# EAGLE design OPEnS-RTC-1.2 (improvements) (EAGLE 9.3.0)

## Sheet 1 of 2
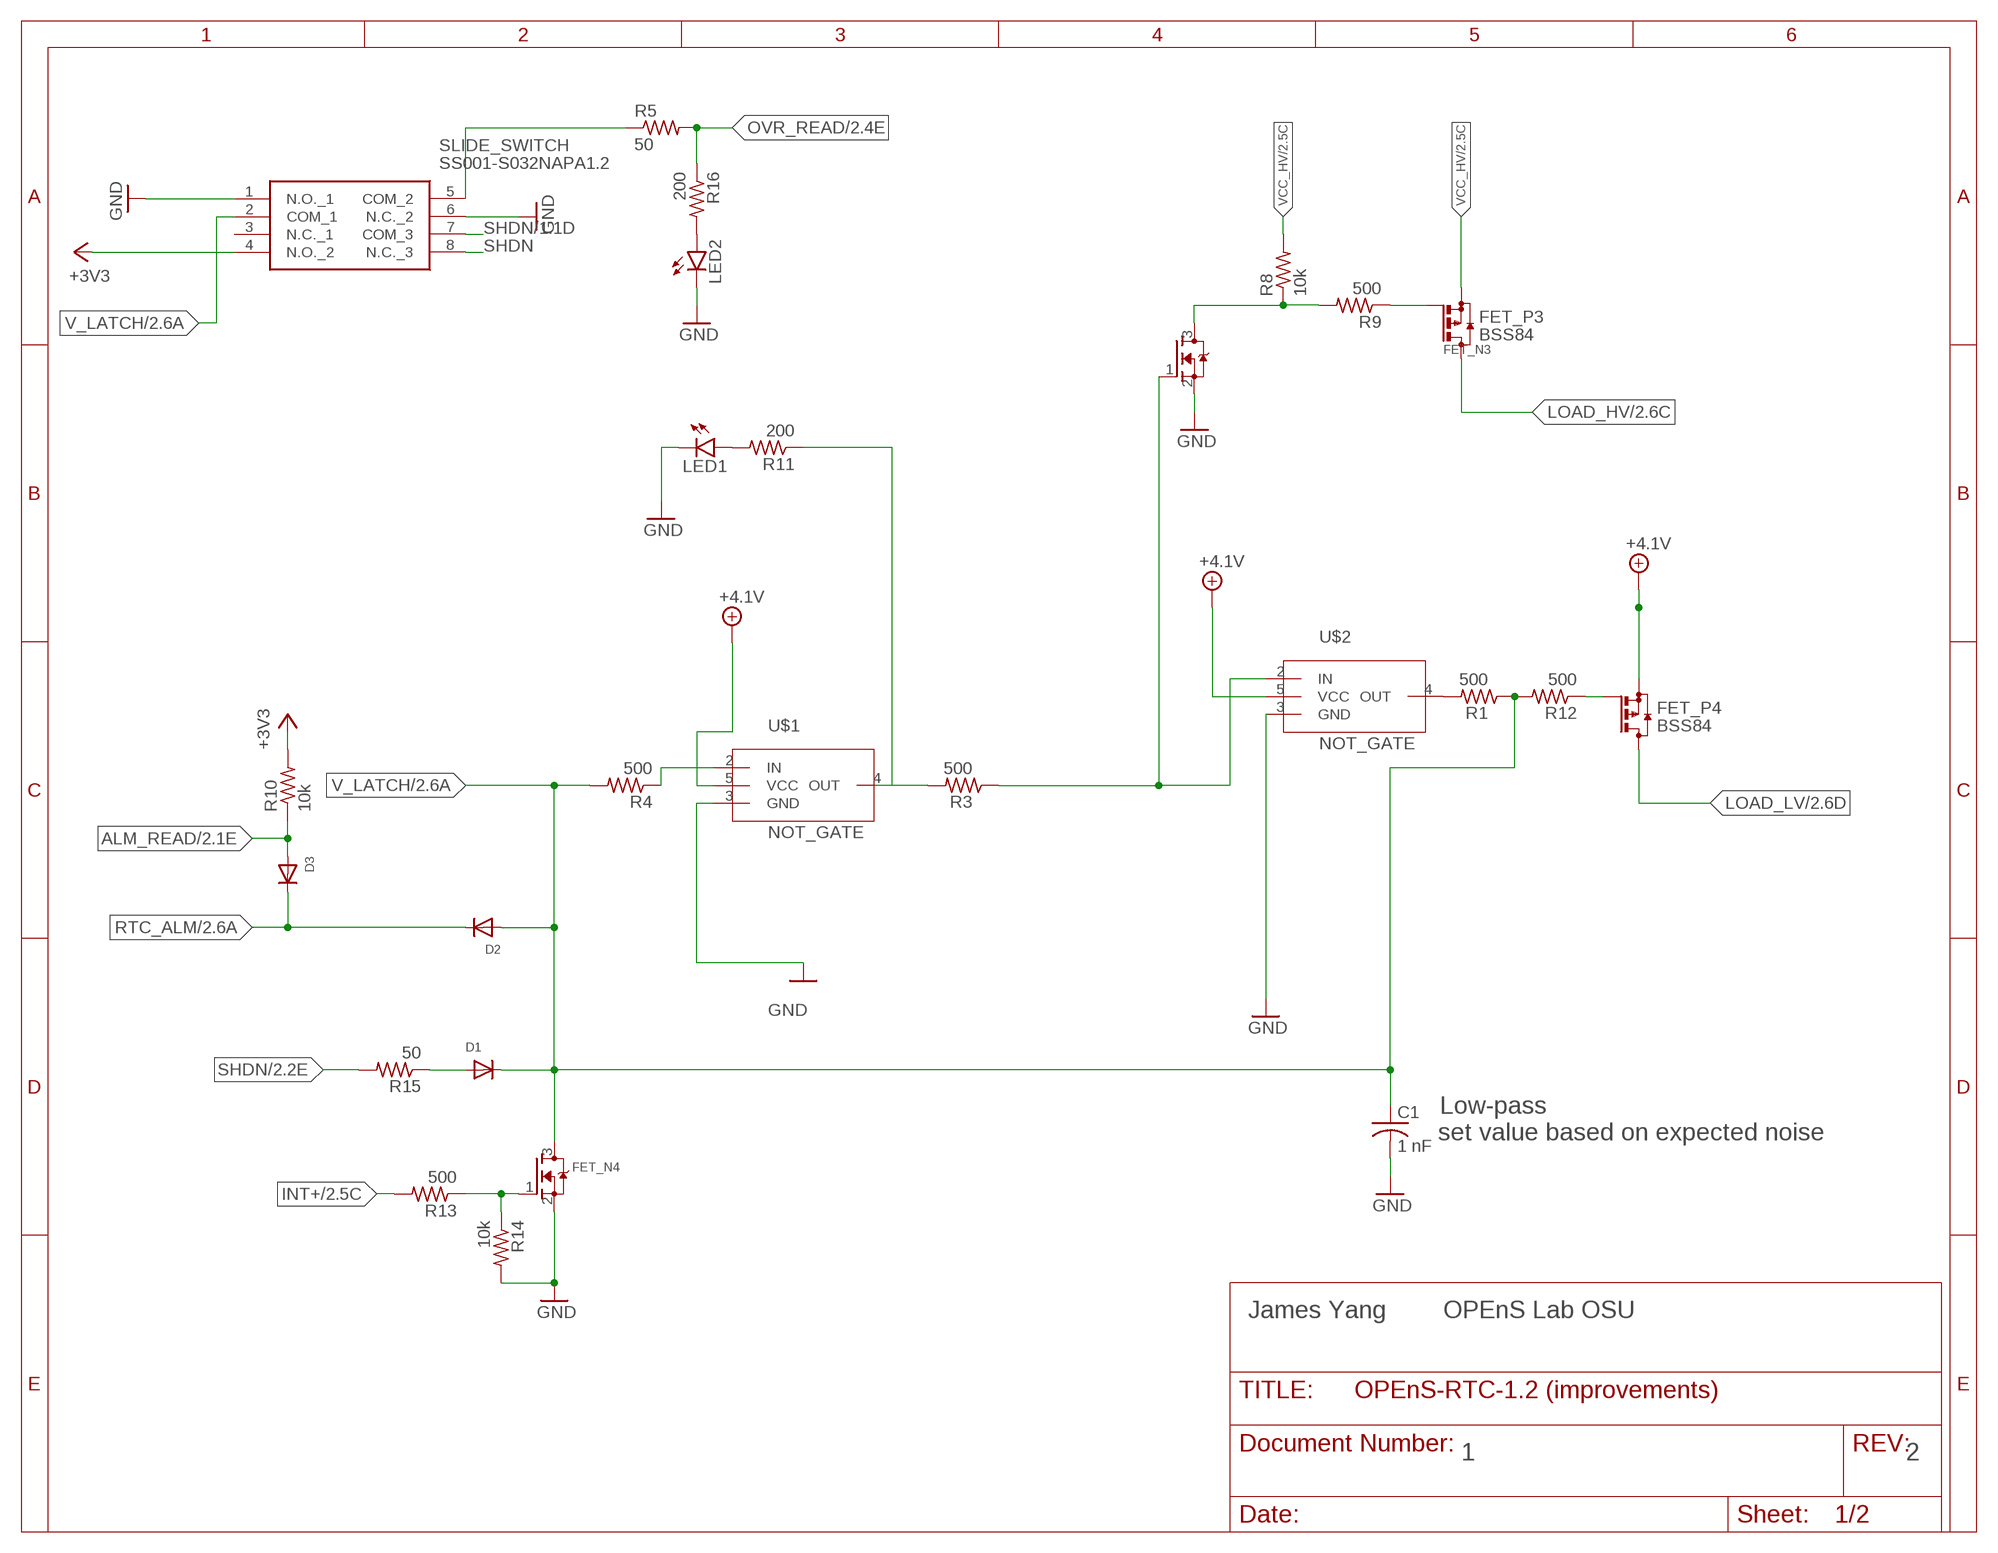
[diagram p0: schematic, sheet 1]

### Parts
C1  1 nF  C-USC0805  [C0805]
D1  DIODESOD-123  [SOD-123]
D2  DIODESOD-123  [SOD-123]
D3  DIODESOD-123  [SOD-123]
FET_N3  MOSFET-NREFLOW  [SOT23]
FET_N4  MOSFET-NREFLOW  [SOT23]
FET_P3  BSS84  [SOT23]
FET_P4  BSS84  [SOT23]
LED1  LEDSMT1206  [1206]
LED2  LEDSMT1206  [1206]
R1  500  R-US_R0805  [R0805]
R3  500  R-US_R0805  [R0805]
R4  500  R-US_R0805  [R0805]
R5  50  R-US_R0805  [R0805]
R8  10k  R-US_R0805  [R0805]
R9  500  R-US_R0805  [R0805]
R10  10k  R-US_R0805  [R0805]
R11  200  R-US_R0805  [R0805]
R12  500  R-US_R0805  [R0805]
R13  500  R-US_R0805  [R0805]
R14  10k  R-US_R0805  [R0805]
R15  50  R-US_R0805  [R0805]
R16  200  R-US_R0805  [R0805]
SLIDE_SWITCH  SS001-S032NAPA1.2  [SS001S032NAPA12]
U$1  NOT_GATE  [SOT753]
U$2  NOT_GATE  [SOT753]

### Nets
+3V3: R10.2 SLIDE_SWITCH.4(N.O._2)
+4.1V: FET_P4.2(S) U$1.5(VCC) U$2.5(VCC) ; also sheet 2
ALM_READ: D3.A R10.1 ; also sheet 2
GND: C1.2 FET_N3.2(S) FET_N4.2(S) LED1.C LED2.C R14.2 SLIDE_SWITCH.1(N.O._1) SLIDE_SWITCH.6(N.C._2) U$1.3(GND) U$2.3(GND) ; also sheet 2
INT+: R13.2 ; also sheet 2
LOAD_HV: FET_P3.3(D) ; also sheet 2
LOAD_LV: FET_P4.3(D) ; also sheet 2
N$1: R11.1 U$1.4(OUT)
N$2: R4.1 U$1.2(IN)
N$3: R1.2 U$2.4(OUT)
N$4: FET_N3.1(G) R3.1 U$2.2(IN)
N$5: FET_N3.3(D) R8.1 R9.2
N$7: R5.1 SLIDE_SWITCH.5(COM_2)
N$8: FET_P3.1(G) R9.1
N$9: LED1.A R11.2
N$10: FET_P4.1(G) R12.1
N$11: D1.A R15.1
N$12: FET_N4.1(G) R13.1 R14.1
N$13: LED2.A R16.2
OVR_READ: R5.2 R16.1 ; also sheet 2
RTC_ALM: D2.C D3.C ; also sheet 2
SHDN: R15.2 SLIDE_SWITCH.8(N.C._3) ; also sheet 2
SHDN/1.1D: SLIDE_SWITCH.7(COM_3)
V_LATCH: C1.1 D1.C D2.A FET_N4.3(D) R1.1 R4.2 R12.2 SLIDE_SWITCH.2(COM_1) ; also sheet 2
V_LATCH1: R3.2
VCC_HV: FET_P3.2(S) R8.2 ; also sheet 2
Unconnected: SLIDE_SWITCH.3(N.C._1)

### Notes on the sheet
- Low-pass
- set value based on expected noise
- James Yang | OPEnS Lab OSU
- 1 | 2

## Sheet 2 of 2
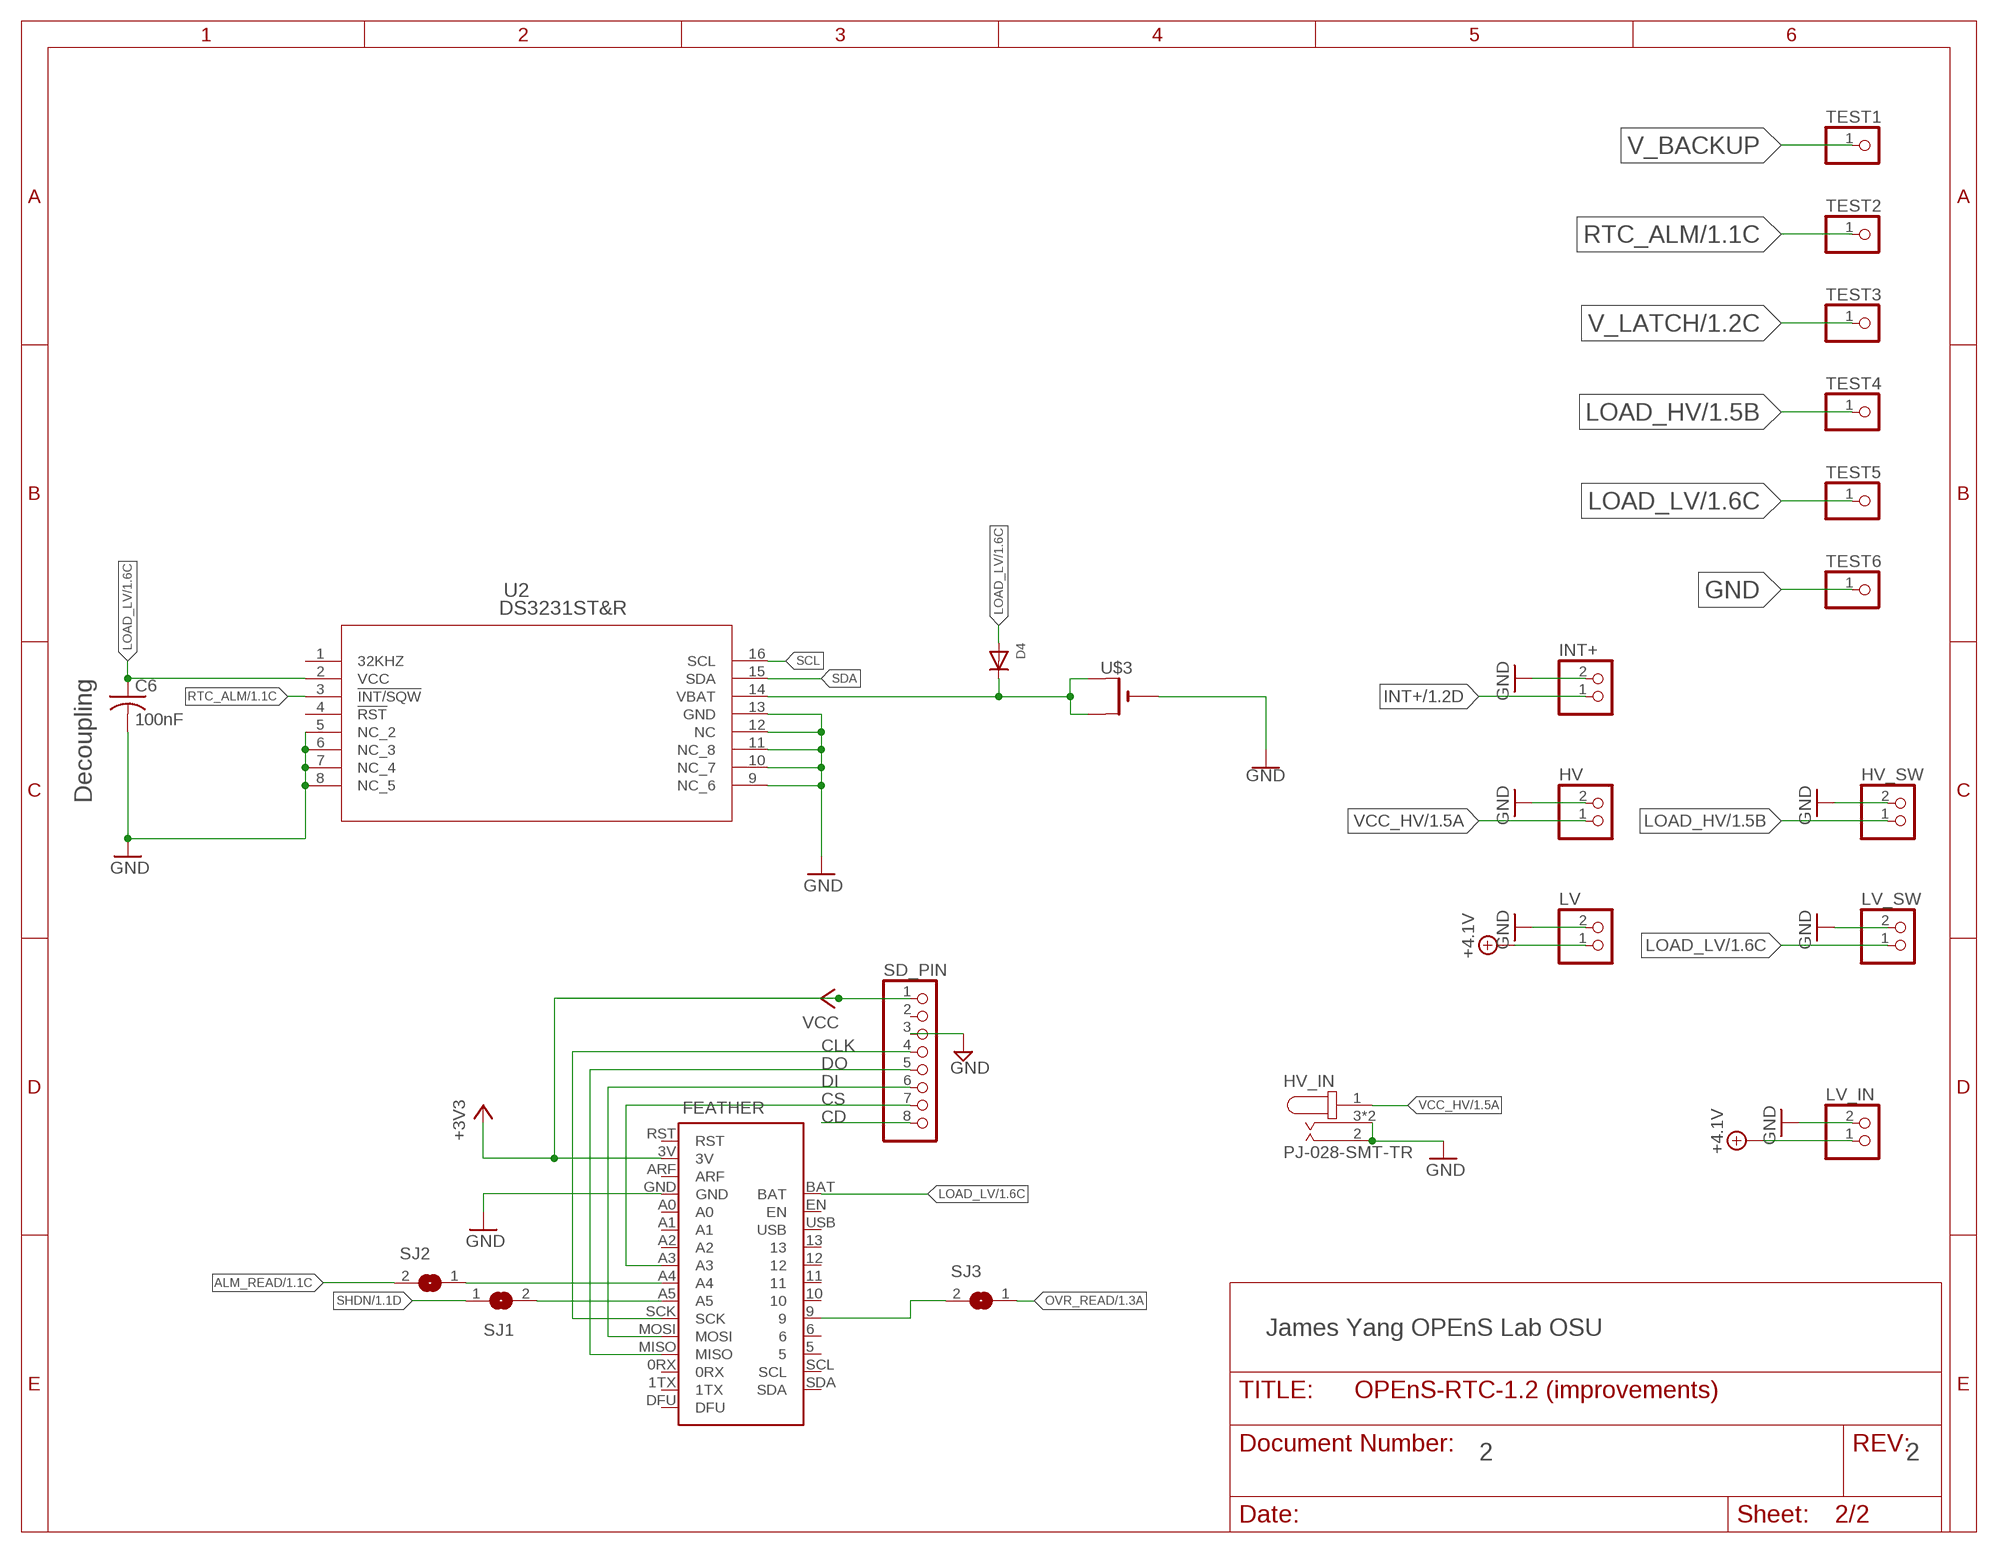
[diagram p1: schematic, sheet 2]

### Parts
C6  100nF  C-USC0805  [C0805]
D4  DIODESOD-123  [SOD-123]
FEATHER  BLUEFRUIT_M0  [BLUEFRUIT_MO]
HV  JST_2PIN-SMT  [JST-PH-2-SMT]
HV_IN  PJ-028-SMT-TR  [CUI_PJ-028-SMT-TR]
HV_SW  JST_2PIN-SMT  [JST-PH-2-SMT]
INT+  JST_2PIN-SMT  [JST-PH-2-SMT]
LV  JST_2PIN-SMT  [JST-PH-2-SMT]
LV_IN  JST_2PIN-SMT  [JST-PH-2-SMT]
LV_SW  JST_2PIN-SMT  [JST-PH-2-SMT]
SD_PIN  PINHD-1X8BIG  [1X08-BIG]
SJ1  SJ  [SJ]
SJ2  SJ  [SJ]
SJ3  SJ  [SJ]
TEST1  PINHD-1X1  [1X01]
TEST2  PINHD-1X1  [1X01]
TEST3  PINHD-1X1  [1X01]
TEST4  PINHD-1X1  [1X01]
TEST5  PINHD-1X1  [1X01]
TEST6  PINHD-1X1  [1X01]
U2  DS3231ST&R  [21-0042B_16]
U$3  CR1220SMT  [CR1220-SMD]

### Nets
+4.1V: LV.1 LV_IN.1 ; also sheet 1
ALM_READ: SJ2.2 ; also sheet 1
CD: SD_PIN.8
CLK: FEATHER.SCK SD_PIN.4
CS: FEATHER.A3 SD_PIN.7
DI: FEATHER.MOSI SD_PIN.6
DO: FEATHER.MISO SD_PIN.5
GND: C6.2 FEATHER.GND HV.2 HV_IN.2 HV_IN.3 HV_IN.3.1 HV_SW.2 INT+.2 LV.2 LV_IN.2 LV_SW.2 SD_PIN.3 TEST6.1 U2.5(NC_2) U2.6(NC_3) U2.7(NC_4) U2.8(NC_5) U2.9(NC_6) U2.10(NC_7) U2.11(NC_8) U2.12(NC) U2.13(GND) U$3.- ; also sheet 1
INT+: INT+.1 ; also sheet 1
LOAD_HV: HV_SW.1 TEST4.1 ; also sheet 1
LOAD_LV: C6.1 D4.A FEATHER.BAT LV_SW.1 TEST5.1 U2.2(VCC) ; also sheet 1
N$14: FEATHER.A4 SJ2.1
N$15: FEATHER.A5 SJ1.2
N$17: FEATHER.9 SJ3.2
OVR_READ: SJ3.1 ; also sheet 1
RTC_ALM: TEST2.1 U2.3(!INT/SQW) ; also sheet 1
SCL: U2.16(SCL)
SDA: U2.15(SDA)
SHDN: SJ1.1 ; also sheet 1
V_BACKUP: D4.C TEST1.1 U2.14(VBAT) U$3.+$1(+) U$3.+$2(+1)
V_LATCH: TEST3.1 ; also sheet 1
VCC: FEATHER.3V SD_PIN.1 ; supply symbol labelled +3V3
VCC_HV: HV.1 HV_IN.1 ; also sheet 1
Unconnected: FEATHER.0RX FEATHER.1TX FEATHER.5 FEATHER.6 FEATHER.10 FEATHER.11 FEATHER.12 FEATHER.13 FEATHER.A0 FEATHER.A1 FEATHER.A2 FEATHER.ARF FEATHER.DFU FEATHER.EN FEATHER.RST FEATHER.SCL FEATHER.SDA FEATHER.USB SD_PIN.2 U2.1(32KHZ) U2.4(!RST)

### Notes on the sheet
- Decoupling
- James Yang OPEnS Lab OSU
- 2 | 2

## Library data of the parts
C1 = rcl:C-US: CAPACITOR, American symbol; SPICEPREFIX: C
C6 = adafruit:C-US: CAPACITOR, American symbol
D1-D4 = adafruit:DIODE: Diode SMADIODE - SMA Surface Mount Package 20V 1A Schottky Diode Digikey: 641-1014-6-ND DO-1N4148 - Through Hole Small Current Diode SOD-123 20V 1 A (.5mV Vf) Schottky Diode - Digikey: MBRX120TPMSCT-ND SOD-323 10V 570mA (.38mV Vf, 3ns) Schottky Diode - Digikey: ZLLS410CT-ND SOD-523 30V 30mA Schottky Diode (RB751S-40TE61) - Digikey: RB751S-40TE61CT-ND SOT23-R/W - SOT23 Package (R = Solder Paste/Reflow Ovens, W = Hand-Soldering) BAT54Film 40V 300mA - Digikey: 497-7162-1-ND
FEATHER = OPEnS-RTC:BLUEFRUIT_M0: Adafruit's M0 Bluefruit / Bluetooth board layout
FET_N3 FET_N4 = adafruit:MOSFET-N: N-Channel Mosfet 2N7002E - 60V 260mA SOT23 [Digikey: 2N7002ET1GOSTR-ND] - REEL BSH103 - 30V 850mA SOT23 [Digikey: 568-5013-1-ND]
FET_P3 FET_P4 = transistor-small-signal:BSS84: P-CHANNEL MOS FET
HV HV_SW INT+ LV LV_IN LV_SW = adafruit:JST_2PIN: JST 2-Pin Connectors of various flavors SMT-RA (S2B-PH-SM4) 4UConnector #17311 SMT (B2B-PH-SM4) THM-RA (S2B-PH) THM (B2B-PH)
HV_IN = OPEnS-RTC:PJ-028-SMT-TR: 24 VDC 2.5 A Right Angle Surface Mount 3 Conductors 3 Contacts Male Power Jack; CUI_PURCHASE_URL: https://www.cui.com/product/interconnect/connectors/dc-power-connectors/jacks/pj-028-smt-tr?utm_source=snapeda.com&utm_medium=referral&utm_campaign=snapedaBOM; DESCRIPTION: 0.8 x 3.35 mm, 2.5 A, Horizontal, Surface Mount _SMT_, Shielded, Dc Power Jack Connector; DIGI-KEY_PART_NUMBER: CP-028PJCT-ND; DIGI-KEY_PURCHASE_URL: https://www.digikey.com/product-detail/en/cui-inc/PJ-028-SMT-TR/CP-028PJCT-ND/1530985?utm_source=snapeda&utm_medium=aggregator&utm_campaign=symbol; MF: CUI Inc.; MP: PJ-028-SMT-TR; PACKAGE: None
LED1 LED2 = led:LED: LED OSRAM: - CHIPLED LG R971, LG N971, LY N971, LG Q971, LY Q971, LO R971, LY R971 LH N974, LH R974 LS Q976, LO Q976, LY Q976 LO Q996 - Hyper CHIPLED LW Q18S LB Q993, LB Q99A, LB R99A - SideLED LS A670, LO A670, LY A670, LG A670, LP A670 LB A673, LV A673, LT A673, LW A673 LH A674 LY A675 LS A676, LA A676, LO A676, LY A676, LW A676 LS A679, LY A679, LG A679 - Hyper Micro SIDELED® LS Y876, LA Y876, LO Y876, LY Y876 LT Y87S - SmartLED LW L88C, LW L88S LB L89C, LB L89S, LG L890 LS L89K, LO L89K, LY L89K LS L896, LA L896, LO L896, LY L896 - TOPLED LS T670, LO T670, LY T670, LG T670, LP T670 LSG T670, LSP T670, LSY T670, LOP T670, LYG T670 LG T671, LOG T671, LSG T671 LB T673, LV T673, LT T673, LW T673 LH T674 LS T676, LA T676, LO T676, LY T676, LB T676, LH T676, LSB T676, LW T676 LB T67C, LV T67C, LT T67C, LS T67K, LO T67K, LY T67K, LW E67C LS E67B, LA E67B, LO E67B, LY E67B, LB E67C, LV E67C, LT E67C LW T67C LS T679, LY T679, LG T679 LS T770, LO T770, LY T770, LG T770, LP T770 LB T773, LV T773, LT T773, LW T773 LH T774 LS E675, LA E675, LY E675, LS T675 LS T776, LA T776, LO T776, LY T776, LB T776 LHGB T686 LT T68C, LB T68C - Hyper Mini TOPLED® LB M676 - Mini TOPLED Santana® LG M470 LS M47K, LO M47K, LY M47K Source: http://www.osram.convergy.de LUXEON: - LUMILED® LXK2-PW12-R00, LXK2-PW12-S00, LXK2-PW14-U00, LXK2-PW14-V00 LXK2-PM12-R00, LXK2-PM12-S00, LXK2-PM14-U00 LXK2-PE12-Q00, LXK2-PE12-R00, LXK2-PE12-S00, LXK2-PE14-T00, LXK2-PE14-U00 LXK2-PB12-K00, LXK2-PB12-L00, LXK2-PB12-M00, LXK2-PB14-N00, LXK2-PB14-P00, LXK2-PB14-Q00 LXK2-PR12-L00, LXK2-PR12-M00, LXK2-PR14-Q00, LXK2-PR14-R00 LXK2-PD12-Q00, LXK2-PD12-R00, LXK2-PD12-S00 LXK2-PH12-R00, LXK2-PH12-S00 LXK2-PL12-P00, LXK2-PL12-Q00, LXK2-PL12-R00 Source: www.luxeon.com KINGBRIGHT: KA-3528ASYC Source: www.kingbright.com
R1 R3-R5 R8-R16 = rcl:R-US_: RESISTOR, American symbol; SPICEPREFIX: R
SD_PIN = adafruit:PINHD-1X8: PIN HEADER
SJ1-SJ3 = jumper:SJ: SMD solder JUMPER
SLIDE_SWITCH = SamacSys_Parts:SS001-S032NAPA1.2: Slide Switches SLIDE SWITCH 3 POL 2 POS NS SMD Source: Datasheet <https://componentsearchengine.com/Datasheets/1/SS001-S032NAPA1.2.pdf>; DESCRIPTION: Slide Switches SLIDE SWITCH 3 POL 2 POS NS SMD; HEIGHT: 2.1mm; MANUFACTURER_NAME: Well Buying; MANUFACTURER_PART_NUMBER: SS001-S032NAPA1.2; MOUSER_PART_NUMBER: 107-SS001-S032NAPA12; MOUSER_PRICE-STOCK: https://www.mouser.com/Search/Refine.aspx?Keyword=107-SS001-S032NAPA12
TEST1-TEST6 = pinhead:PINHD-1X1: PIN HEADER
U2 = power8:DS3231ST&R: DS3231 RTC IC only; MANUFACTURER_PART_NUMBER: DS3231S#T&R; VENDOR: Maxim Integrated Products
U$1 U$2 = eDNA:NOT_GATE: Logic INVERTER, also known as NOT gate. SOT753 footprint. SOT753 version can be ordered from https://www.digikey.com/product-detail/en/toshiba-semiconductor-and-storage/TC4S584FLF/TC4S584FLFCT-ND/870444 Bao Nguyen - OpenSensingLab
U$3 = adafruit:CR1220: CR1216/CR1220/CR1225 12mm 3V lithium coin cell Great for battery packup. Both SMT and THM holders. Note the THM package has the ground pads on both sides of the PCB so that the masks are the same - this reduces the cost

## Board
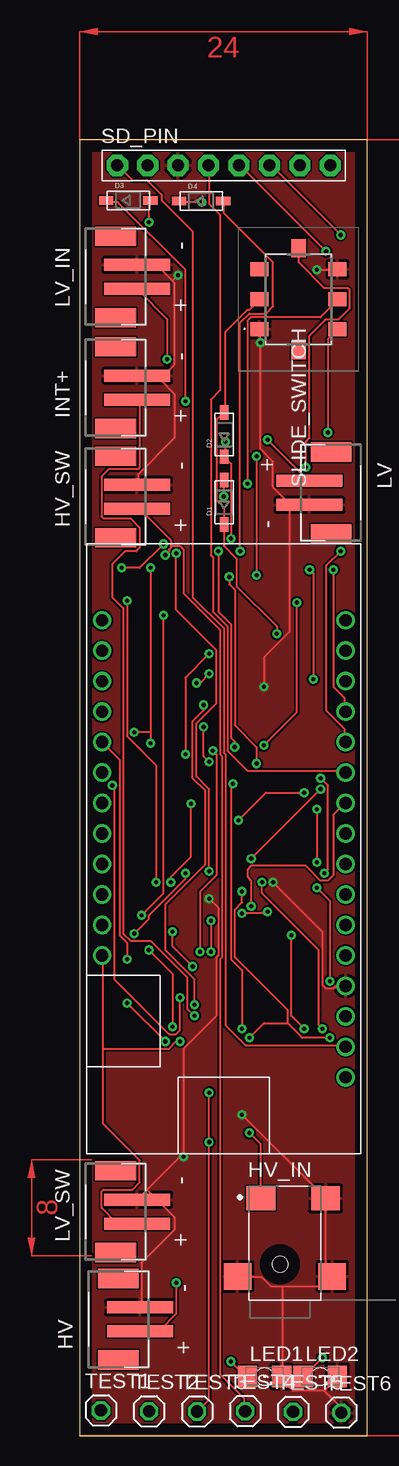
[diagram p2: board, top side]
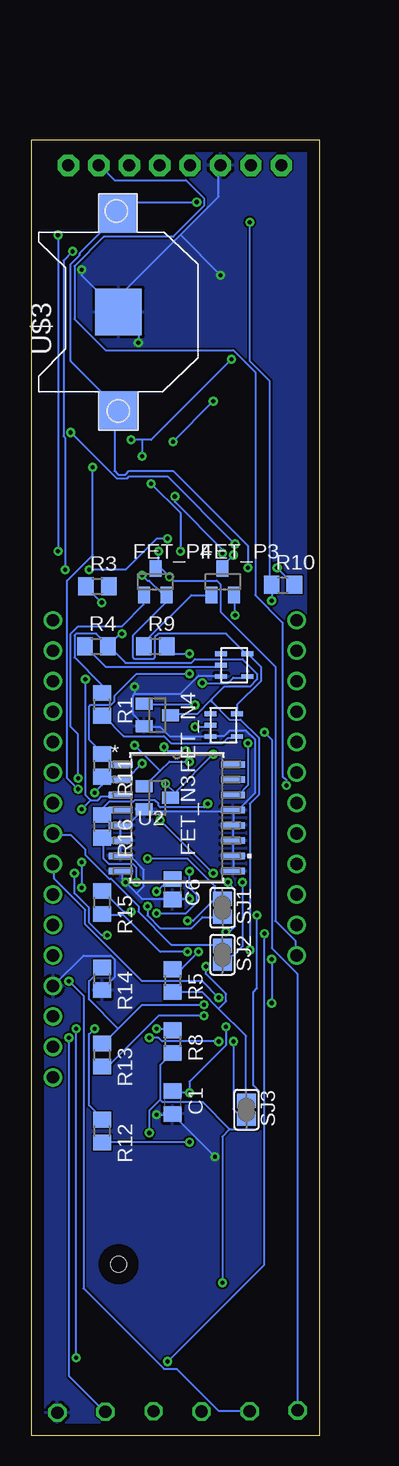
[diagram p3: board, bottom side, seen from below]

Size 24 x 108 mm. Coordinates in mm from the lower left corner, seen from the top.
Outline: 0,0 24,0 24,108 0,108 0,0
Copper layers (1*16): Top 0.035mm / dielectric 1.5mm / Bottom 0.035mm
Design rules "default": minimum track width 6mil, minimum drill 0.35mm, track to track 6mil, track to pad 6mil, pad to pad 6mil, via to via 6mil, smd to smd 6mil, copper to edge 40mil, drill to drill 6mil, minimum pad ring 10mil, minimum via ring 8mil, stop-mask expansion 4mil, vias tented up to drill 0mil, thermal gap 10mil

### Footprints (pad centres in the part's own frame; a part is rotated, then mirrored left to right if it is on the bottom)
C0805 = smd 1.3 x 1.5: 1 -0.95,0; 2 0.95,0
C0805' = smd 1.3 x 1.5: 1 -0.85,0; 2 0.85,0
SOD-123 = smd 1.2 x 0.7: A 1.85,0; C -1.85,0
BLUEFRUIT_MO = drill 1.016: 0RX 39.37,1.27; 1TX 41.91,1.27; 3V 8.89,1.27; 5 39.37,21.59; 6 36.83,21.59; 9 34.29,21.59; 10 31.75,21.59; 11 29.21,21.59; 12 26.67,21.59; 13 24.13,21.59; A0 16.51,1.27; A1 19.05,1.27; A2 21.59,1.27; A3 24.13,1.27; A4 26.67,1.27; A5 29.21,1.27; ARF 11.43,1.27; BAT 16.51,21.59; DFU 44.45,1.27; EN 19.05,21.59; GND 13.97,1.27; MISO 36.83,1.27; MOSI 34.29,1.27; RST 6.35,1.27; SCK 31.75,1.27; SCL 41.91,21.59; SDA 44.45,21.59; USB 21.59,21.59
SOT23 = smd 1 x 1.4: 1 -0.95,-1.1; 2 0.95,-1.1; 3 0,1.1
JST-PH-2-SMT = smd 1 x 5.5: 1 -1,-1.8; 2 1,-1.8 | smd 1.6 x 3.4: NC1 -3.4,0; NC2 3.4,0
CUI_PJ-028-SMT-TR = smd 2.4 x 2: 1 -2,3.75; 2 3.4,3.75 | smd 2.3 x 2.2: 3 -3.95,-2.75; 3.1 3.95,-2.75 | hole 1.3: -0.4,-1.75
1206 = smd 1.6 x 1.803: A -1.422,0; C 1.422,0
R0805 = smd 1.3 x 1.5: 1 -0.95,0; 2 0.95,0
1X08-BIG = drill 1.016 pad 1.778 octagon: 1 -8.89,0; 2 -6.35,0; 3 -3.81,0; 4 -1.27,0; 5 1.27,0; 6 3.81,0; 7 6.35,0; 8 8.89,0
SJ = smd 1.168 x 1.6: 1 -0.762,0; 2 0.762,0
SS001S032NAPA12 = smd 1.2 x 1.5: 1 -2.5,3.25; 2 0,3.25; 3 2.5,3.25; 4 -2.5,-3.25; 5 0,-3.25; 6 2.5,-3.25 | smd 1.5 x 1.2: 7 -4.25,0; 8 4.25,0
1X01 = drill 1.016 octagon: 1 0,0
21-0042B_16 = smd 1.981 x 0.533: 1 -4.686,4.445; 2 -4.686,3.175; 3 -4.686,1.905; 4 -4.686,0.635; 5 -4.686,-0.635; 6 -4.686,-1.905; 7 -4.686,-3.175; 8 -4.686,-4.445; 9 4.686,-4.445; 10 4.686,-3.175; 11 4.686,-1.905; 12 4.686,-0.635; 13 4.686,0.635; 14 4.686,1.905; 15 4.686,3.175; 16 4.686,4.445
SOT753 = smd 1 x 0.4: 1 -1.14,0.95; 2 -1.14,0; 3 -1.14,-0.95; 4 1.06,-0.95; 5 1.06,0.95
CR1220-SMD = smd 3.2 x 3.2: +$1 -8.2,0; +$2 8.2,0 | smd 3.9 x 3.9: - 0,0

### Placement (x,y rotation side)
C1  12.23,27.75 270 bottom
C6  100nF  [C0805']  12.23,45.53 270 bottom
D1  12.07,77.77 90 top
D2  12.07,83.42 90 top
D3  4.07,102.93 0 top
D4  10.16,102.87 0 top
FEATHER  23.48,23.5 90 top
FET_N3  13.5,53.15 270 bottom
FET_N4  13.5,60.04 270 bottom
FET_P3  8.05,71.15 0 bottom
FET_P4  13.67,71.15 0 bottom
HV  3.25,9.69 90 top
HV_IN  17.14,16.02 0 top
HV_SW  3.01,78.22 90 top
INT+  3.01,87.33 90 top
LED1  15.44,4.93 0 top
LED2  20.09,4.93 0 top
LV  20.99,78.56 270 top
LV_IN  3.01,96.55 90 top
LV_SW  3.01,18.66 90 top
R1  18.12,60.93 270 bottom
R3  18.51,70.77 0 bottom
R4  18.59,65.77 0 bottom
R5  12.23,37.91 270 bottom
R8  12.23,32.83 270 bottom
R9  13.67,65.77 0 bottom
R10  3.02,70.88 0 bottom
R11  18.12,55.85 270 bottom
R12  18.12,25.37 270 bottom
R13  18.12,31.72 270 bottom
R14  18.12,38.07 270 bottom
R15  18.12,44.42 270 bottom
R16  18.12,50.77 270 bottom
SD_PIN  12.04,105.85 0 top
SJ1  8.07,43.99 270 bottom
SJ2  8.07,40.07 270 bottom
SJ3  6.07,27.15 270 bottom
SLIDE_SWITCH  18.28,94.69 90 top
TEST1  1.79,2.1 0 top
TEST2  5.8,2.02 0 top
TEST3  9.81,2 0 top
TEST4  13.82,2.03 0 top
TEST5  17.83,1.98 0 top
TEST6  21.84,1.9 0 top
U2  11.88,51.48 0 bottom
U$1  7.05,64.2 0 bottom
U$2  7.94,59.2 0 bottom
U$3  16.75,93.63 90 bottom

### Tracks (layer width: path | path; a pad name or v marks a point on that pad's centre or on a via)
+3V3  (via drill 0.35)
  Top 0.152: v3.5,72.31 5.03,72.31 v7.01,74.29 | v20.73,83.59 20.73,91.36 21.49,92.12 SLIDE_SWITCH.4
  Bottom 0.152: v3.5,72.31 2.13,70.94 R10.2 | v7.01,74.29 12.65,79.93 15.85,79.93 16,79.78 16.92,79.78 v20.73,83.59
+4.1V  (via drill 0.35)
  Top 0.152: v15.7,82.98 19.05,79.63 LV.1 | v7.32,89.69 7.32,93.04 4.88,95.48 LV_IN.1 | v14.78,81.61 v14.78,71.7
  Bottom 0.152: U$2.5 6.86,60.27 6.86,60.88 4.88,62.86 4.88,64.08 5.94,65.15 U$1.5 6.1,65.15 7.77,66.83 13.41,66.83 13.72,66.52 13.72,64.84 13.87,64.69 15.39,64.69 15.54,64.84 15.54,66.67 12.8,69.42 12.8,70.03 FET_P4.2 12.8,70.18 13.11,70.18 14.17,71.25 14.33,71.25 v14.78,71.7 | 14.78,82.98 14.02,82.98 v7.32,89.69 | 14.78,82.98 v15.7,82.98 | 14.78,82.98 v14.78,81.61
ALM_READ  (via drill 0.35)
  Top 0.152: v5.79,101.12 5.79,102.79 D3.A | v6.4,46.1 6.4,55.85 3.96,58.29 v3.96,69.57
  Bottom 0.152: v5.79,101.12 5.79,89.53 4.12,87.86 4.12,70.94 R10.1 3.96,70.79 v3.96,69.57 | v6.4,46.1 6.4,40.77 7.16,40 7.32,40 7.92,39.39 SJ2.2
CLK
  Top 0.152: FEATHER.SCK 22.1,55.4 14.02,55.4 12.34,57.07 12.34,67.44 11.12,68.66 11.12,73.23 10.97,73.38 10.97,86.33 11.73,87.1 11.73,101.73 10.82,102.64 10.82,105.84 SD_PIN.4
CS  (via drill 0.35)
  Top 0.152: v8.38,36.5 8.38,33.76 8.08,33.45 7.47,33.45 2.9,38.02 2.9,54.02 v2.74,54.18
  Bottom 0.152: v8.38,36.5 9.75,37.87 14.78,37.87 19.51,42.59 19.51,43.81 22.1,46.41 22.1,47.62 FEATHER.A3 | v2.74,54.18 2.74,54.63 3.05,54.94 3.05,67.74 5.33,70.03 5.33,88.62 7.16,90.45 17.83,90.45 20.42,93.04 20.42,97.46 17.98,99.9 12.19,99.9 9.6,102.49 9.6,103.1 11.12,104.62 17.07,104.62 18.29,105.84 SD_PIN.7
DI  (via drill 0.35)
  Top 0.152: v21.79,73.68 20.57,72.47 20.57,60.43 22.1,58.9 22.1,57.84 FEATHER.MOSI | v21.79,100.05 16,105.84 SD_PIN.6
  Bottom 0.152: v21.79,100.05 v21.79,73.68
DO  (via drill 0.35)
  Top 0.152: v21.18,72.16 21.18,62.41 22.1,61.49 22.1,60.43 FEATHER.MISO | v20.57,98.68 13.41,105.84 SD_PIN.5
  Bottom 0.152: v21.18,72.16 21.18,83.13 21.34,83.29 21.34,97.92 v20.57,98.68
GND  (via drill 0.35)
  Top 0.152: 5.64,20.5 4.88,19.73 LV_SW.2 | 5.64,20.5 8.38,23.24 v8.69,23.24 8.69,32.23 11.43,34.98 11.43,39.85 11.58,40 11.58,43.97 v10.82,44.73 | 5.64,20.5 7.92,18.21 7.92,17.14 5.18,14.4 5.18,10.74 HV.2 | 20.42,3.73 17.83,3.73 17.53,4.04 17.53,4.19 16.92,4.8 LED1.C 16.92,4.95 16.92,12.42 | 20.42,3.73 21.49,4.8 LED2.C | 20.42,3.73 21.79,2.36 21.79,1.9 TEST6.1 | 16.92,12.42 20.27,12.42 21.03,13.18 HV_IN.3.1 21.03,13.33 20.57,13.79 20.57,19.73 HV_IN.2 20.42,19.89 v13.56,26.75 | 16.92,12.42 16,12.42 15.24,13.18 13.26,13.18 HV_IN.3 | v16.15,46.1 20.27,41.98 20.27,37.57 20.57,37.26 21.18,37.26 21.34,37.41 22.1,37.41 FEATHER.GND | 6.71,88.01 6.4,88.31 4.88,88.31 INT+.2 6.71,88.01 | 6.71,88.01 7.92,86.79 7.92,83.13 4.88,80.08 4.88,79.32 HV_SW.2 | 7.77,96.24 7.92,96.09 7.92,89.23 6.71,88.01 | 7.77,96.24 6.55,97.46 4.88,97.46 LV_IN.2 | 17.53,77.65 16.15,79.02 16.15,81.15 15.09,82.22 v15.09,91.06 15.09,92.12 SLIDE_SWITCH.1 | 17.53,77.65 19.05,77.65 LV.2 17.53,77.65 | v19.81,97.15 21.49,97.15 SLIDE_SWITCH.6 | v8.23,96.7 7.77,96.24 | v15.39,62.41 15.39,64.84 17.53,66.98 17.53,77.65
  Bottom 0.152: v8.69,23.24 12.19,26.75 C1.2 12.34,26.75 v13.56,26.75 | 15.39,61.8 11.58,61.8 10.06,63.32 8.23,63.32 U$1.3 | 15.39,61.8 15.54,61.65 15.54,60.12 14.63,59.21 FET_N4.2 14.48,59.05 13.26,59.05 12.5,58.29 9.14,58.29 U$2.3 8.99,58.29 7.92,58.29 7.47,58.75 6.1,58.75 5.33,57.99 5.33,53.57 6.71,52.2 7.16,52.2 U2.13 | R14.2 17.98,37.26 17.07,38.17 17.07,39.7 17.37,40 19.66,40 22.1,37.57 FEATHER.GND | U2.13 7.16,52.04 7.16,50.98 U2.12 7.16,50.82 7.16,49.6 U2.11 7.16,49.45 7.16,48.39 U2.10 7.16,48.23 7.16,47.17 U2.9 | 15.24,45.19 v16.15,46.1 16.46,46.41 16.46,47.01 U2.8 | 15.24,45.19 14.78,44.73 12.34,44.73 C6.2 12.19,44.73 v10.82,44.73 | 15.24,45.19 14.63,45.8 14.63,47.17 15.7,48.23 16.46,48.23 U2.7 16.61,48.39 16.61,49.45 U2.6 16.61,49.6 16.61,50.82 U2.5 16.46,50.98 15.85,50.98 14.63,52.2 FET_N3.2 14.48,52.2 14.33,52.04 7.32,52.04 U2.13 | v19.81,97.15 19.81,96.7 17.37,94.26 | 17.37,94.26 16.76,93.65 U$3.- | 17.37,94.26 11.58,100.05 | 11.58,100.05 8.38,103.25 8.38,105.84 SD_PIN.3 | 17.37,94.26 U$3.- | v15.09,91.06 15.09,91.97 16.61,93.5 U$3.- | 11.58,100.05 v8.23,96.7 | v15.39,62.41 15.39,61.8
  pour Top: 0,108 0,0 24,0 24,108
  pour Bottom: 0,108 0,0 24,0 24,108
INT+  (via drill 0.35)
  Top 0.152: v9.6,34.98 8.99,35.58 8.99,38.17 5.94,41.22 4.27,41.22 3.66,41.83 3.66,68.96 2.74,69.87 2.74,72.62 3.81,73.68 4.72,73.68 5.03,73.99 5.03,75.67 4.27,76.43 1.98,76.43 1.83,76.58 1.83,79.93 2.44,80.54 4.88,80.54 5.03,80.69 5.03,86.03 4.88,86.18 INT+.1
  Bottom 0.152: v9.6,34.98 13.41,34.98 17.53,30.86 17.98,30.86 R13.2
LOAD_HV  (via drill 0.35)
  Top 0.152: v7.16,73.38 7.47,73.68 7.47,73.84 7.62,73.99 7.62,74.14 | 7.62,74.14 7.62,74.6 4.88,77.34 HV_SW.1 | 7.62,74.14 8.38,74.14 8.69,73.84 8.69,70.18 11.73,67.13 11.73,56.77 11.89,56.62 11.89,39.85 11.73,39.7 11.73,5.1 13.72,3.12 13.72,2.06 TEST4.1
  Bottom 0.152: v7.16,73.38 7.92,72.62 7.92,72.31 FET_P3.3
LOAD_LV  (via drill 0.35)
  Top 0.152: v13.56,45.34 13.56,44.42 12.95,43.81 12.95,39.85 17.37,35.43 17.37,34.36 | 17.37,34.36 18.59,33.15 v20.88,33.15 | 1.98,32.23 1.98,25.98 5.03,22.94 5.03,21.11 4.42,20.5 1.98,20.5 1.83,20.34 1.83,18.97 3.05,17.75 4.72,17.75 LV_SW.1 | 1.98,32.23 1.98,40 FEATHER.BAT | v13.41,73.68 13.41,92.73 14.17,93.5 15.54,93.5 16.15,94.11 16.15,97.76 12.04,101.88 12.04,102.79 D4.A | v14.78,56.01 14.78,57.38 12.95,59.21 12.95,70.48 12.5,70.94 v12.5,71.55 | 17.37,34.36 15.39,34.36 v14.17,33.15 | v8.38,32.84 8.08,32.84 7.47,32.23 1.98,32.23
  Bottom 0.152: v13.56,45.34 12.65,46.25 12.34,46.25 C6.1 | v20.88,33.15 20.88,4.95 17.98,2.06 TEST5.1 | 13.41,72.47 v13.41,73.68 | 13.41,72.47 13.56,72.31 FET_P4.3 13.41,72.47 | v14.78,56.01 16,54.79 16.46,54.79 U2.2 | 13.41,72.47 v12.5,71.55 12.19,71.25 8.53,71.25 8.23,70.94 8.23,68.66 3.66,64.08 3.66,42.9 1.98,41.22 1.98,40.16 FEATHER.BAT | v14.17,33.15 13.41,33.15 13.11,32.84 v8.38,32.84
N$1  (via drill 0.35)
  Top 0.152: v9.75,62.71 10.06,62.71 v10.82,63.47
  Bottom 0.152: v9.75,62.71 7.62,62.71 7.16,63.17 6.1,63.17 U$1.4 | v10.82,63.47 15.24,63.47 17.07,61.65 17.07,61.19 17.37,60.88 19.05,60.88 19.2,60.73 19.2,57.99 18.14,56.92 R11.1
N$2
  Bottom 0.152: U$1.2 8.23,64.08 17.83,64.08 19.51,65.76 R4.1
N$3
  Bottom 0.152: U$2.4 7.01,58.14 7.62,58.14 8.08,57.68 12.34,57.68 12.95,58.29 16.31,58.29 17.98,59.97 R1.2
N$4  (via drill 0.35)
  Top 0.152: v10.36,59.05 10.36,56.62 v10.82,56.16 | v18.14,69.42 18.14,60.27 v15.39,57.53
  Bottom 0.152: v10.36,59.05 9.14,59.05 U$2.2 | v10.82,56.16 12.5,56.16 13.26,55.4 | 13.26,55.4 14.48,54.18 FET_N3.1 | v18.14,69.42 19.36,70.64 R3.1 | 13.26,55.4 v15.39,57.53
N$5  (via drill 0.35)
  Top 0.152: v8.84,56.77 8.84,63.17 v10.82,65.15 | v13.56,33.91 13.56,38.78 12.65,39.7 12.65,54.18 v12.8,54.33
  Bottom 0.152: v8.84,56.77 12.04,53.57 | 12.04,53.57 12.34,53.26 FET_N3.3 12.04,53.57 | v10.82,65.15 12.04,65.15 12.65,65.76 R9.2 | v13.56,33.91 12.34,33.91 R8.1 | 12.04,53.57 v12.8,54.33
N$7  (via drill 0.35)
  Top 0.152: v10.06,40.31 10.06,45.34 11.43,46.71 11.43,56.77 v11.12,57.07 | v12.95,57.38 12.95,57.84 12.65,58.14 12.65,67.59 11.58,68.66 v11.58,73.68 | v14.02,79.32 14.02,92.89 14.33,93.19 20.12,93.19 21.49,94.56 SLIDE_SWITCH.5
  Bottom 0.152: v10.06,40.31 11.43,38.94 12.19,38.94 R5.1 | v11.12,57.07 12.65,57.07 v12.95,57.38 | v11.58,73.68 11.58,76.89 v14.02,79.32
N$8
  Bottom 0.152: FET_P3.1 9.14,70.03 10.67,70.03 14.48,66.22 14.48,65.91 R9.1
N$9  (via drill 0.35)
  Top 0.152: v18.75,53.57 15.54,53.57 v13.26,51.28 | v8.84,46.86 8.84,46.41 5.79,43.36 5.79,43.05 v4.57,41.83 | v12.65,6.17 13.87,4.95 LED1.A
  Bottom 0.152: v18.75,53.57 18.14,54.18 18.14,54.79 R11.2 | v8.84,46.86 v13.26,51.28 | v4.57,41.83 4.57,14.25 v12.65,6.17
N$10  (via drill 0.35)
  Top 0.152: v20.12,54.79 20.73,54.18 20.73,47.17 v20.42,46.86 | v17.68,41.68 17.68,34.98 v18.75,33.91
  Bottom 0.152: v20.12,54.79 20.12,58.44 20.73,59.05 20.73,66.83 20.12,67.44 16.46,67.44 14.63,69.27 14.63,70.03 FET_P4.1 | v20.42,46.86 20.42,45.19 19.2,43.97 19.2,42.75 18.14,41.68 v17.68,41.68 | v18.75,33.91 19.2,33.45 19.2,27.51 18.14,26.44 R12.1
N$11  (via drill 0.35)
  Top 0.152: v12.04,78.26 12.04,79.48 D1.A | v8.08,73.53 8.08,68.81 11.43,65.45 11.43,61.03 9.75,59.36 9.75,54.94 10.82,53.87 v10.82,47.01 | v13.56,43.51 15.54,43.51 v15.7,43.66
  Bottom 0.152: v12.04,78.26 12.04,77.8 8.08,73.84 v8.08,73.53 | v10.82,47.01 10.82,45.64 10.21,45.03 10.21,44.42 11.12,43.51 v13.56,43.51 | v15.7,43.66 16.31,43.66 17.98,45.34 R15.1
N$12  (via drill 0.35)
  Top 0.152: v10.36,60.88 10.36,60.43 9.45,59.51 9.45,54.79 10.52,53.72 10.52,47.62 7.16,44.27 7.16,40.46 9.6,38.02 v9.6,35.89
  Bottom 0.152: v10.36,60.88 14.48,60.88 FET_N4.1 | v9.6,35.89 14.78,35.89 16.76,33.91 | 16.76,33.91 17.98,32.69 R13.1 | 16.76,33.91 19.2,36.35 19.2,37.87 18.14,38.94 R14.1
N$13  (via drill 0.35)
  Top 0.152: v15.24,46.1 15.24,45.19 19.96,40.46 19.96,34.21 v20.27,33.91 | v20.27,6.48 18.75,4.95 LED2.A
  Bottom 0.152: v15.24,46.1 15.24,47.32 15.54,47.62 17.53,47.62 17.98,48.08 17.98,49.76 R16.2 | v20.27,6.48 v20.27,33.91
N$14
  Bottom 0.152: SJ2.1 8.08,40.92 12.34,40.92 15.09,43.66 15.09,44.12 17.37,46.41 17.53,46.41 19.51,48.39 19.51,48.84 20.73,50.06 22.1,50.06 FEATHER.A4
N$15  (via drill 0.35)
  Top 0.152: v14.33,44.12 14.33,46.25 14.02,46.56 14.02,47.17 14.33,47.47 18.9,47.47 20.12,46.25 20.73,46.25 21.18,46.71 21.18,51.74 22.1,52.65 FEATHER.A5
  Bottom 0.152: v14.33,44.12 14.33,43.36 13.26,42.29 10.67,42.29 9.75,43.2 8.08,43.2 SJ1.2
N$17  (via drill 0.35)
  Top 0.152: v3.96,36.04 v7.16,32.84 | v3.96,39.7 3.96,41.07 3.35,41.68 3.35,56.31 1.98,57.68 FEATHER.9
  Bottom 0.152: v7.16,32.84 7.16,27.2 6.4,26.44 6.1,26.44 SJ3.2 | v3.96,39.7 v3.96,36.04
OVR_READ  (via drill 0.35)
  Top 0.152: v9.3,52.65 9.3,48.23 7.62,46.56 v7.62,46.1 | v7.77,41.98 7.77,40.77 v9.45,39.09
  Bottom 0.152: 8.38,35.58 6.1,33.3 6.1,27.96 SJ3.1 | 8.38,35.58 9.75,36.96 12.19,36.96 R5.2 | v9.3,52.65 9.6,52.35 13.26,52.35 13.41,52.5 13.41,52.65 13.72,52.96 15.39,52.96 15.54,52.81 17.53,52.81 17.98,52.35 17.98,51.74 R16.1 | v7.62,46.1 7.01,45.49 7.01,42.44 7.47,41.98 v7.77,41.98 | v9.45,39.09 9.45,38.48 7.77,36.8 7.77,36.19 8.38,35.58
RTC_ALM  (via drill 0.35)
  Top 0.152: v8.84,86.18 8.84,97.15 3.2,102.79 2.29,102.79 D3.C | v12.19,82.83 12.19,81.61 D2.C 12.19,81.46 12.65,81 v12.65,74.75 | v19.51,63.02 19.51,71.86 v19.2,72.16 | v20.88,37.87 20.88,44.58 v19.81,45.64 | v19.81,52.2 v19.81,47.78
  Bottom 0.152: v12.19,82.83 v8.84,86.18 | 19.05,52.96 18.44,52.96 18.14,53.26 16.61,53.26 U2.3 | 19.05,52.96 19.51,53.41 v19.51,63.02 | v19.2,72.16 16.15,72.16 13.56,74.75 v12.65,74.75 | v20.88,37.87 19.66,36.65 19.66,12.27 12.95,5.56 11.89,5.56 8.38,2.06 5.94,2.06 TEST2.1 | v19.81,47.78 v19.81,45.64 | 19.05,52.96 v19.81,52.2
SHDN  (via drill 0.35)
  Top 0.152: v10.97,42.9 v10.97,40.31 | v18.9,80.69 18.9,82.83 19.2,83.13 19.2,91.67 20.57,93.04 21.64,93.04 22.55,93.95 22.55,95.48 22.4,95.63 20.42,95.63 18.29,97.76 18.29,98.83 SLIDE_SWITCH.8 | v14.33,48.08 v20.12,53.87
  Bottom 0.152: v10.97,40.31 13.26,40.31 16.31,43.36 17.98,43.36 R15.2 | v10.97,42.9 10.52,42.9 8.69,44.73 | 8.69,44.73 8.08,44.73 SJ1.1 8.69,44.73 | v18.9,80.69 18.9,73.38 21.03,71.25 21.03,54.79 v20.12,53.87 | v14.33,48.08 10.97,48.08 8.69,45.8 8.69,44.73
V_BACKUP  (via drill 0.35)
  Top 0.152: v10.21,102.79 8.38,102.79 D4.C | v5.94,72.31 5.94,58.6 | 5.94,58.6 v5.94,57.68 | 5.94,58.6 v4.57,58.6
  Bottom 0.152: v10.21,102.79 15.7,102.79 16.61,101.88 U$3.+$2 16.76,101.73 19.96,98.53 19.96,98.37 20.73,97.61 20.73,89.53 16.76,85.57 U$3.+$1 16.76,85.42 17.07,85.11 17.07,80.39 16.76,80.08 16.15,80.08 15.85,80.39 12.19,80.39 5.94,74.14 v5.94,72.31 | v5.94,57.68 5.94,54.18 6.71,53.41 7.16,53.41 U2.14 | v4.57,58.6 3.96,57.99 3.96,40.61 1.83,38.48 1.83,2.21 TEST1.1
V_LATCH  (via drill 0.35)
  Top 0.152: v10.82,28.57 v10.82,24.46 10.82,2.97 9.91,2.06 TEST3.1 | SLIDE_SWITCH.2 14.94,94.56 14.17,93.8 14.02,93.8 12.19,91.97 12.19,85.42 D2.A 12.04,85.27 11.43,84.66 11.43,77.95 12.04,77.34 12.04,75.97 D1.C 12.04,75.82 12.04,74.14 13.11,73.08 13.11,70.79 16.46,67.44 v16.46,66.83 | v7.77,34.06 7.77,38.48 v5.79,40.46
  Bottom 0.152: C1.1 12.19,28.57 v10.82,28.57 10.82,29.49 7.77,32.54 v7.77,34.06 | v10.82,24.46 17.98,24.46 R12.2 | 8.99,61.34 7.92,62.41 5.79,62.41 5.18,63.02 5.18,63.47 6.4,64.69 10.36,64.69 10.67,64.39 16.15,64.39 17.53,65.76 R4.2 | 8.99,61.34 10.21,60.12 12.34,60.12 FET_N4.3 | R1.1 18.14,61.95 18.14,62.56 20.42,64.84 20.42,66.67 20.27,66.83 18.59,66.83 17.68,65.91 R4.2 | v16.46,66.83 16.61,66.83 17.53,65.91 R4.2 | v5.79,40.46 5.79,52.65 5.03,53.41 5.03,58.14 6.55,59.66 7.47,59.66 8.99,61.19 8.99,61.34
VCC
  Top 0.152: FEATHER.3V 22.1,32.54 13.87,32.54 12.19,34.21 12.19,56.77 12.04,56.92 12.04,67.28 9.45,69.87 9.45,100.35 6.86,102.94 6.86,103.4 5.64,104.62 4.42,104.62 3.2,105.84 SD_PIN.1
VCC_HV  (via drill 0.35)
  Top 0.152: v7.01,68.35 7.01,45.19 v5.18,43.36 | v14.17,25.22 15.09,24.31 15.09,19.89 HV_IN.1 | v8.08,12.72 8.08,10.13 6.71,8.76 5.18,8.76 HV.1
  Bottom 0.152: v7.01,68.35 7.01,70.03 FET_P3.2 | v5.18,43.36 5.18,37.26 5.49,36.96 5.49,29.18 5.03,28.73 5.03,25.68 5.18,25.53 7.47,25.53 | 7.47,25.53 9.75,27.81 13.11,27.81 13.26,27.96 | 13.26,27.96 13.26,30.86 12.34,31.77 R8.2 | v14.17,25.22 14.17,27.05 13.26,27.96 | v8.08,12.72 8.08,24.92 7.47,25.53
(copper drawn outside any net)
  shapes: Top area x3